# Altium project H-bridge.PrjPcb
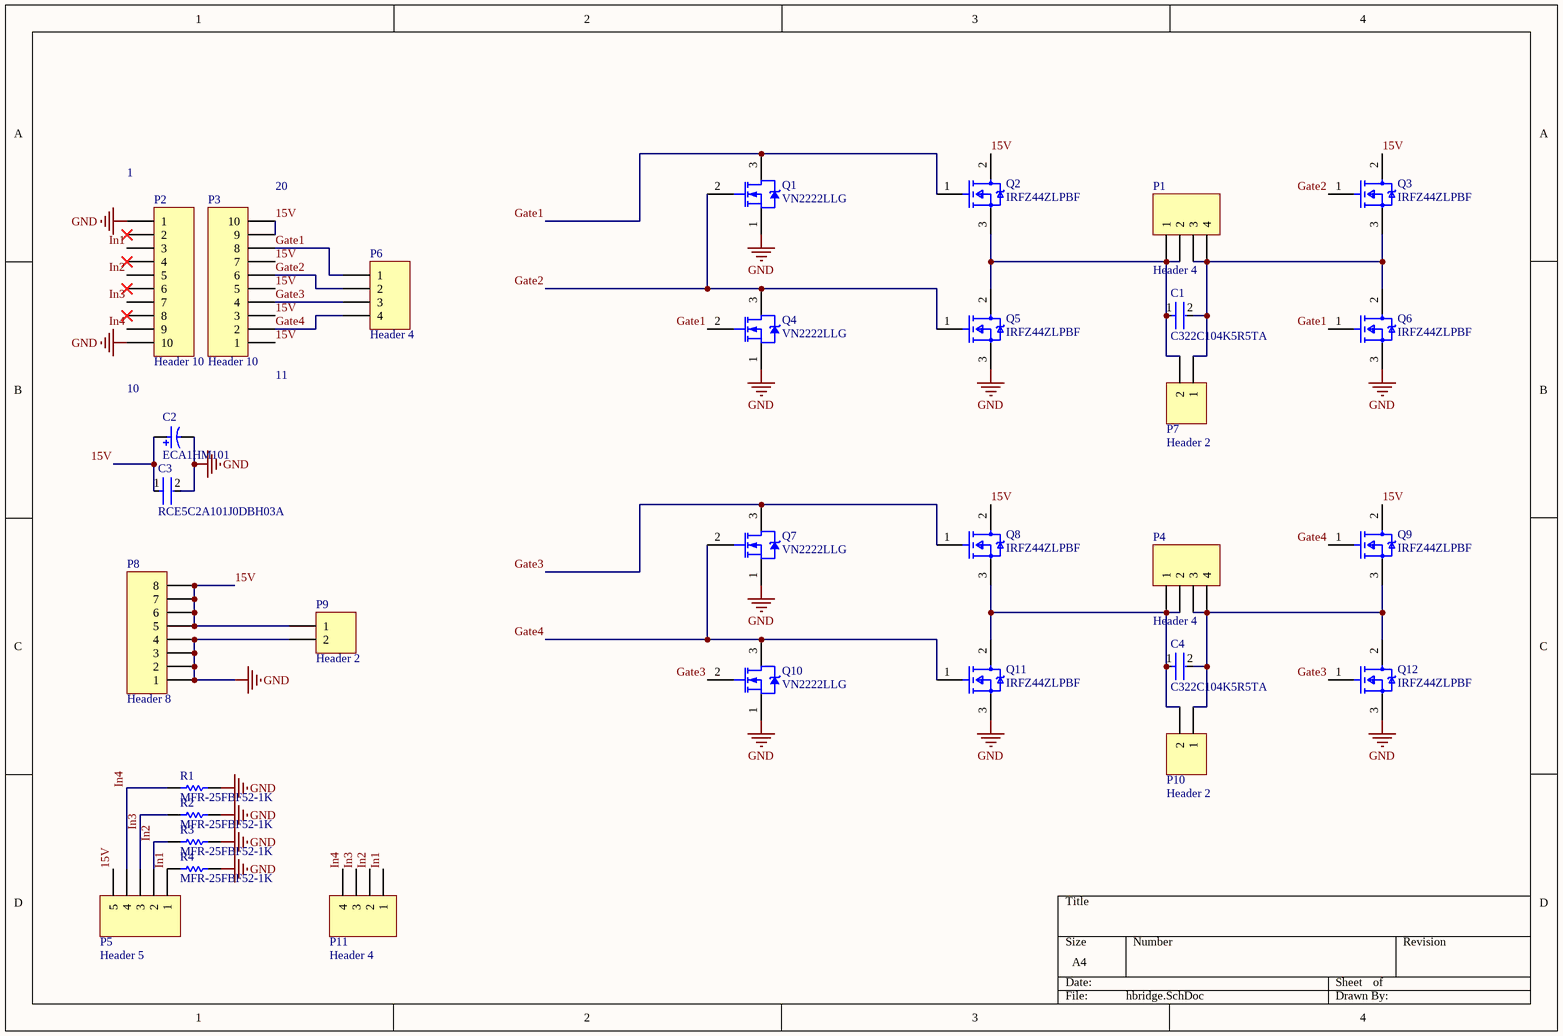
[diagram p0: hbridge.SchDoc]
1 sheet, 31 parts. Net scope: global (net labels, ports and power ports of the same name join across sheets).
Board file: hbridge.PcbDoc

## Sheet hbridge.SchDoc
size A4; SheetNumber: 1; SheetTotal: 1

### Parts
C1  C322C104K5R5TA  [FP-C322C104K5R5TA-MFG]
C2  ECA1HM101  [CAPPR65-350-1150X800X1250]
C3  RCE5C2A101J0DBH03A  [FP-RCE0DB-MFG]
C4  C322C104K5R5TA  [FP-C322C104K5R5TA-MFG]
P1  Header 4  [HDR1X4]
P2  Header 10  [HDR1X10]
P3  Header 10  [HDR1X10]
P4  Header 4  [HDR1X4]
P5  Header 5  [HDR1X5]
P6  Header 4  [HDR1X4]
P7  Header 2  [HDR1X2]
P8  Header 8  [HDR1X8]
P9  Header 2  [HDR1X2]
P10  Header 2  [HDR1X2]
P11  Header 4  [HDR1X4]
Q1  VN2222LLG  [ONSC-TO-92-3-29-11]
Q2  IRFZ44ZLPBF  [FP-PG-TO262-3-MFG]
Q3  IRFZ44ZLPBF  [FP-PG-TO262-3-MFG]
Q4  VN2222LLG  [ONSC-TO-92-3-29-11]
Q5  IRFZ44ZLPBF  [FP-PG-TO262-3-MFG]
Q6  IRFZ44ZLPBF  [FP-PG-TO262-3-MFG]
Q7  VN2222LLG  [ONSC-TO-92-3-29-11]
Q8  IRFZ44ZLPBF  [FP-PG-TO262-3-MFG]
Q9  IRFZ44ZLPBF  [FP-PG-TO262-3-MFG]
Q10  VN2222LLG  [ONSC-TO-92-3-29-11]
Q11  IRFZ44ZLPBF  [FP-PG-TO262-3-MFG]
Q12  IRFZ44ZLPBF  [FP-PG-TO262-3-MFG]
R1  MFR-25FBF52-1K  [RESA60-630X240]
R2  MFR-25FBF52-1K  [RESA60-630X240]
R3  MFR-25FBF52-1K  [RESA60-630X240]
R4  MFR-25FBF52-1K  [RESA60-630X240]

### Nets
GND: C2.2 C3.2 P2.1 P2.10 P8.1 P8.2 P8.3 P8.4 P9.2 Q1.1(S) Q4.1(S) Q5.3(S) Q6.3(S) Q7.1(S) Q10.1(S) Q11.3(S) Q12.3(S) R1.1 R2.1 R3.1 R4.1
15V: C2.1 C3.1 P3.1 P3.3 P3.5 P3.7 P3.9 P3.10 P5.5 P8.5 P8.6 P8.7 P8.8 P9.1 Q2.2(D) Q3.2(D) Q8.2(D) Q9.2(D)
Gate1: P3.8 P6.1 Q1.3(D) Q2.1(G) Q4.2(G) Q6.1(G)
Gate2: P3.6 P6.2 Q1.2(G) Q3.1(G) Q4.3(D) Q5.1(G)
Gate3: P3.4 P6.3 Q7.3(D) Q8.1(G) Q10.2(G) Q12.1(G)
Gate4: P3.2 P6.4 Q7.2(G) Q9.1(G) Q10.3(D) Q11.1(G)
In1: P2.3 P5.1 P11.1 R4.2
In2: P2.5 P5.2 P11.2 R3.2
In3: P2.7 P5.3 P11.3 R2.2
In4: P2.9 P5.4 P11.4 R1.2
NetC1_1: C1.1 P1.1 P1.2 P7.2 Q2.3(S) Q5.2(D)
NetC1_2: C1.2 P1.3 P1.4 P7.1 Q3.3(S) Q6.2(D)
NetC4_1: C4.1 P4.1 P4.2 P10.2 Q8.3(S) Q11.2(D)
NetC4_2: C4.2 P4.3 P4.4 P10.1 Q9.3(S) Q12.2(D)

Not connected (* = marked no-connect by the designer): P2 2* 4* 6* 8*

### Notes on the sheet
- (near P2) 1
- (near P3) 20
- (near P3) 11
- 10

### Library data of the parts
C1 C4 = CMP-03020-034661-1: CAP CER 0.1UF 50V X7R RADIAL; Capacitance: 100nF; Dielectric Material: Ceramic; Dissipation Factor: 2.5%; Lead Length: 7mm; Tolerance: 10%; Lead Diameter: 0.51mm; Lead/Base Style: Formed Leads; Construction: RADIAL; RoHS Compliant: Yes; Voltage Rating (DC): 50V; Packaging: Bulk; Lead Free: Lead Free; Width: 0.125inch; Lead Pitch: 5.08mm; Voltage Rating: 50V; Number of Pins: 2; Radiation Hardening: No; Material: Ceramic; REACH SVHC: No SVHC; Height - Seated (Max): 0.26inch; Case/Package: Radial; Weight: 0.0625lb; Dielectric: X7R; Min Operating Temperature: -55°C; Voltage: 50V; Series: Golden Max™; Max Operating Temperature: 125°C; Height: 3.18mm; Termination: Radial; Length: 5.08mm; Depth: 3.18mm; Package Quantity: 500; Mount: Through Hole
C2 = CMP-1665-00042-2: Aluminum Electrolytic Capacitor, 100 uF, +/- 20%, 50 V, -40 to 85 degC, 2-Pin THD, RoHS, Bulk; Manufacturer: Panasonic; Lead Diameter: 0.6mm; Dielectric Material: Aluminium; Voltage Rating (DC): 50V; Ripple Current (AC): 250mA; Polarity: Polar; Leakage Current: 3uA; Capacitance: 100uF; Life (Hours): 2000Hour; Lead/Base Style: Straight; Dissipation Factor: 0.12%; Radiation Hardening: No; Height: 11.5mm; Package Quantity: 200; Package Reference: CAPPR65-350-1150X800X1250; Min Operating Temperature: -40degC; Mount: ThroughHole; Package Description: 2-Pin Radial Lead, Dia 8 mm, Height 12.5 mm; Case/Package: Radial; Diameter: 8mm; Voltage Rating: 50V; Length: 11.5mm; REACH SVHC: NoSVHC; Height - Seated (Max): 0.492inch; Datasheet URL: https://industrial.panasonic.com/cdbs/www-data/pdf/RDF0000/ABA0000C1218.pdf; RoHSCompliant: true; Ripple Current: 250mA; Lead Free: LeadFree; Voltage: 50V; Manufacturer URL: http://www.panasonic.com/; Number of Pins: 2; Datasheet Version: Rev. 05, 10/2016; Packaging: Bulk; Termination: Radial; Max Operating Temperature: 85degC; Tolerance: 20%; Lead Pitch: 3.5mm
C3 = CMP-06035-022164-1: Cap Ceramic 100pF 100V C0G ±5% Radial 2.5mm +125°C Ammo Pack; Lead Diameter: 0.5mm; Lead/Base Style: Straight; Resistor Type: Ceramic; Termination: Radial; Voltage Rating: 100V; Height: 3.5mm; Min Operating Temperature: -55°C; Packaging: Tape and Reel; Lead Pitch: 0.098inch; Width: 0.098inch; Voltage Rating (DC): 100V; Tolerance: 5%; Capacitance: 100pF; Max Operating Temperature: 125°C; Dielectric: C0G; Height - Seated (Max): 0.138inch; Case/Package: Radial; Length: 0.142inch; Ratings: AEC-Q200; Mount: Through Hole; Package Quantity: 2000
P1 P4 P6 P11 = Header 4: Header, 4-Pin; LatestRevisionDate: 17-Jul-2002; LatestRevisionNote: Re-released for DXP Platform.; Publisher: Altium Limited
P2 P3 = Header 10: Header, 10-Pin; LatestRevisionDate: 17-Jul-2002; LatestRevisionNote: Re-released for DXP Platform.; Publisher: Altium Limited
P5 = Header 5: Header, 5-Pin; LatestRevisionDate: 17-Jul-2002; LatestRevisionNote: Re-released for DXP Platform.; Publisher: Altium Limited
P7 P9 P10 = Header 2: Header, 2-Pin; LatestRevisionDate: 17-Jul-2002; LatestRevisionNote: Re-released for DXP Platform.; Publisher: Altium Limited
P8 = Header 8: Header, 8-Pin; LatestRevisionDate: 17-Jul-2002; LatestRevisionNote: Re-released for DXP Platform.; Publisher: Altium Limited
Q1 Q4 Q7 Q10 = CMP-1058-00930-1: Small Signal MOSFET, 150 mA, 60 V, N-Channel, 3-Pin TO-92, Pb-Free, Bulk Box; Manufacturer: On Semiconductor; ID Max (A): 0.15; VGS(th) Max (V): 2.5; Channel Polarity: N Channel; PD Max (W): 0.4; VGS Max (V): 20; Configuration: Single; V(BR)DSS Min (V): 60; Mounting Technology: Through Hole; ComponentLink3URL: http://www.onsemi.cn/pub_link/Collateral/2N6426-D.PDF; PartNumber: VN2222LLG; Package Type: TO-92; PackageReference: TO-92-3-29-11_AM_SL; Packing: Bulk Box; ComponentLink2Description: Datasheet; ComponentLink3Description: Package Specification; ComponentLink1URL: http://www.onsemi.com/; RoHS: Pb-Free; DatasheetVersion: Rev. 4; ComponentLink1Description: Manufacturer URL; PackageDescription: 3-Pin Transistor Outline, Body 4.825 x 3.685 mm, Pitch 1.27 mm; PackageVersion: Rev. AM; ComponentLink2URL: http://www.onsemi.com/pub_link/Collateral/VN2222LL-D.PDF
Q2 Q3 Q5 Q6 Q8 Q9 Q11 Q12 = CMP-32901-000428-1: MOSFET N-CH 55V 51A TO262; Input Capacitance: 1.42nF; Drain to Source Resistance: 13.9mR; Gate to Source Voltage (Vgs): 20V; Turn-Off Delay Time: 33ns; Power Dissipation: 80W; Element Configuration: Single; Turn-On Delay Time: 14ns; Continuous Drain Current (ID): 51A; Max Operating Temperature: 175°C; Max Dual Supply Voltage: 55V; Drain to Source Voltage (Vdss): 55V; RoHS Compliant: Yes; Halogen Free: Halogen Free; Rds On Max: 13.9mR; Mount: Through Hole; Width: 0.19inch; Min Operating Temperature: -55°C; Length: 0.419inch; Lead Free: Contains Lead; Max Power Dissipation: 80W; Packaging: Rail/Tube; Height: 0.355inch; Number of Pins: 3; Case/Package: TO-262
R1-R4 = CMP-1659-00075-1: Axial Resistor, 1 KOhm, +/- 1%, 250 mW, -55 to 155 degC, 2-Pin THD, RoHS, Bulk; Voltage Rating: 250 V; Resistance: 10 kohm; Power Rating: 250 mW; ComponentLink2Description: Datasheet; RoHSCompliant: true; PackageReference: MFR-25; Case\Package: Axial; Max Operating Temperature: 155 degC; DatasheetVersion: Apr-13; Tolerance: 1%; ComponentLink1URL: http://www.yageo.com/; Length: 0.248 inch; ComponentLink2URL: http://www.yageo.com/documents/recent/Yageo%20LR_MFR_2013.pdf; Packaging: Bulk; Package Quantity: 200; PackageDescription: 2-Pin Axial Lead, Dia 2.4 mm, Body Length 6.3 mm; Min Operating Temperature: -55 degC; ComponentLink1Description: Manufacturer URL